# Altium schematic sheet Sheet5.SchDoc
size A4
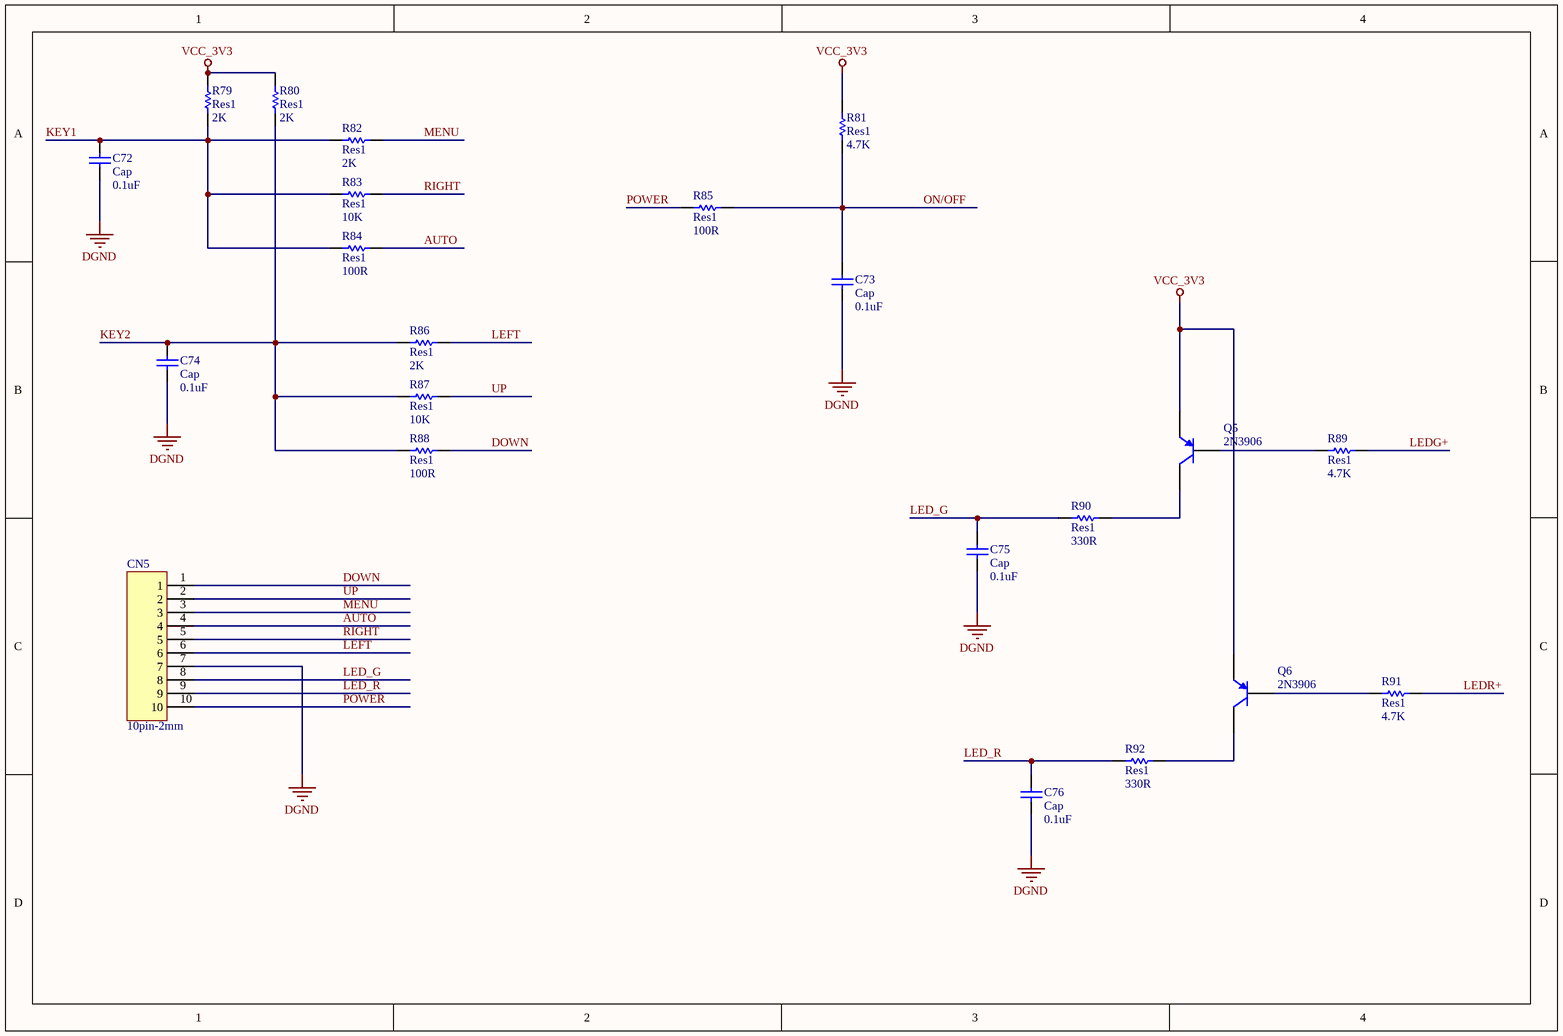
[diagram p0: Sheet5.SchDoc]

## Parts
C72  Cap  value 0.1uF  [C-0402]
C73  Cap  value 0.1uF  [C-0402]
C74  Cap  value 0.1uF  [C-0402]
C75  Cap  value 0.1uF  [C-0402]
C76  Cap  value 0.1uF  [C-0402]
CN5  10pin-2mm  [JP-10]
Q5  2N3906  [Q-SOT23]
Q6  2N3906  [Q-SOT23]
R79  Res1  value 2K  [R-0603]
R80  Res1  value 2K  [R-0603]
R81  Res1  value 4.7K  [R-0603]
R82  Res1  value 2K  [R-0603]
R83  Res1  value 10K  [R-0603]
R84  Res1  value 100R  [R-0603]
R85  Res1  value 100R  [R-0603]
R86  Res1  value 2K  [R-0603]
R87  Res1  value 10K  [R-0603]
R88  Res1  value 100R  [R-0603]
R89  Res1  value 4.7K  [R-0603]
R90  Res1  value 330R  [R-0603]
R91  Res1  value 4.7K  [R-0603]
R92  Res1  value 330R  [R-0603]

## Nets
DGND: C72.1 C73.1 C74.1 C75.1 C76.1 CN5.7
VCC_3V3: Q5.1(E) Q6.1(E) R79.2 R80.2 R81.1
AUTO: CN5.4 R84.1
DOWN: CN5.1 R88.1
KEY1: C72.2 R79.1 R82.2 R83.2 R84.2
KEY2: C74.2 R80.1 R86.2 R87.2 R88.2
LED_G: C75.2 CN5.8 R90.1
LED_R: C76.2 CN5.9 R92.1
LEDG+: R89.2
LEDR+: R91.2
LEFT: CN5.6 R86.1
MENU: CN5.3 R82.1
ON/OFF: C73.2 R81.2 R85.1
POWER: CN5.10 R85.2
RIGHT: CN5.5 R83.1
UP: CN5.2 R87.1
NetQ5_2: Q5.2(B) R89.1
NetQ5_3: Q5.3(C) R90.2
NetQ6_2: Q6.2(B) R91.1
NetQ6_3: Q6.3(C) R92.2

## Library data of the parts
C72-C76 = Cap: Capacitor; Published: 8-Jun-2000; LatestRevisionDate: 17-Jul-2002; LatestRevisionNote: Re-released for DXP Platform.; PackageReference: RAD-0.3; Publisher: Altium Limited; PackageDescription: Radial Cap, Thru-Hole; 2 Leads; 0.3 in Pin Spacing
Q5 Q6 = 2N3906: PNP General Purpose Amplifier; Published: 8-Jun-2000; LatestRevisionDate: 15-Jan-2003; LatestRevisionNote: PCB Footprint 'BCY-W3/D4.7' replaced; DatasheetVersion: 1997; PackageVersion: Sep-1998; PackageReference: TO-92A; Publisher: Altium Limited; PackageDescription: TO, Flat Index; 3 In-Line, Axial Leads; Body Dia. 4.5mm; Leads 0.51 x 0.48 mm (max); ComponentLink1Description: Manufacturer Link; ComponentLink1URL: http://www.fairchildsemi.com/; ComponentLink2Description: Datasheet; ComponentLink2URL: http://www.fairchildsemi.com/ds/2N%2F2N3906.pdf
R79-R92 = Res1: Resistor; Published: 8-Jun-2000; LatestRevisionDate: 17-Jul-2002; LatestRevisionNote: Re-released for DXP Platform.; PackageReference: AXIAL-0.3; Publisher: Altium Limited; PackageDescription: Axial Device, Thru-Hole; 2 Leads; 0.3 in Pin Spacing